# Altium schematic sheet Connector.SchDoc: Connectors
size A4; SheetNumber: 4; SheetTotal: 5
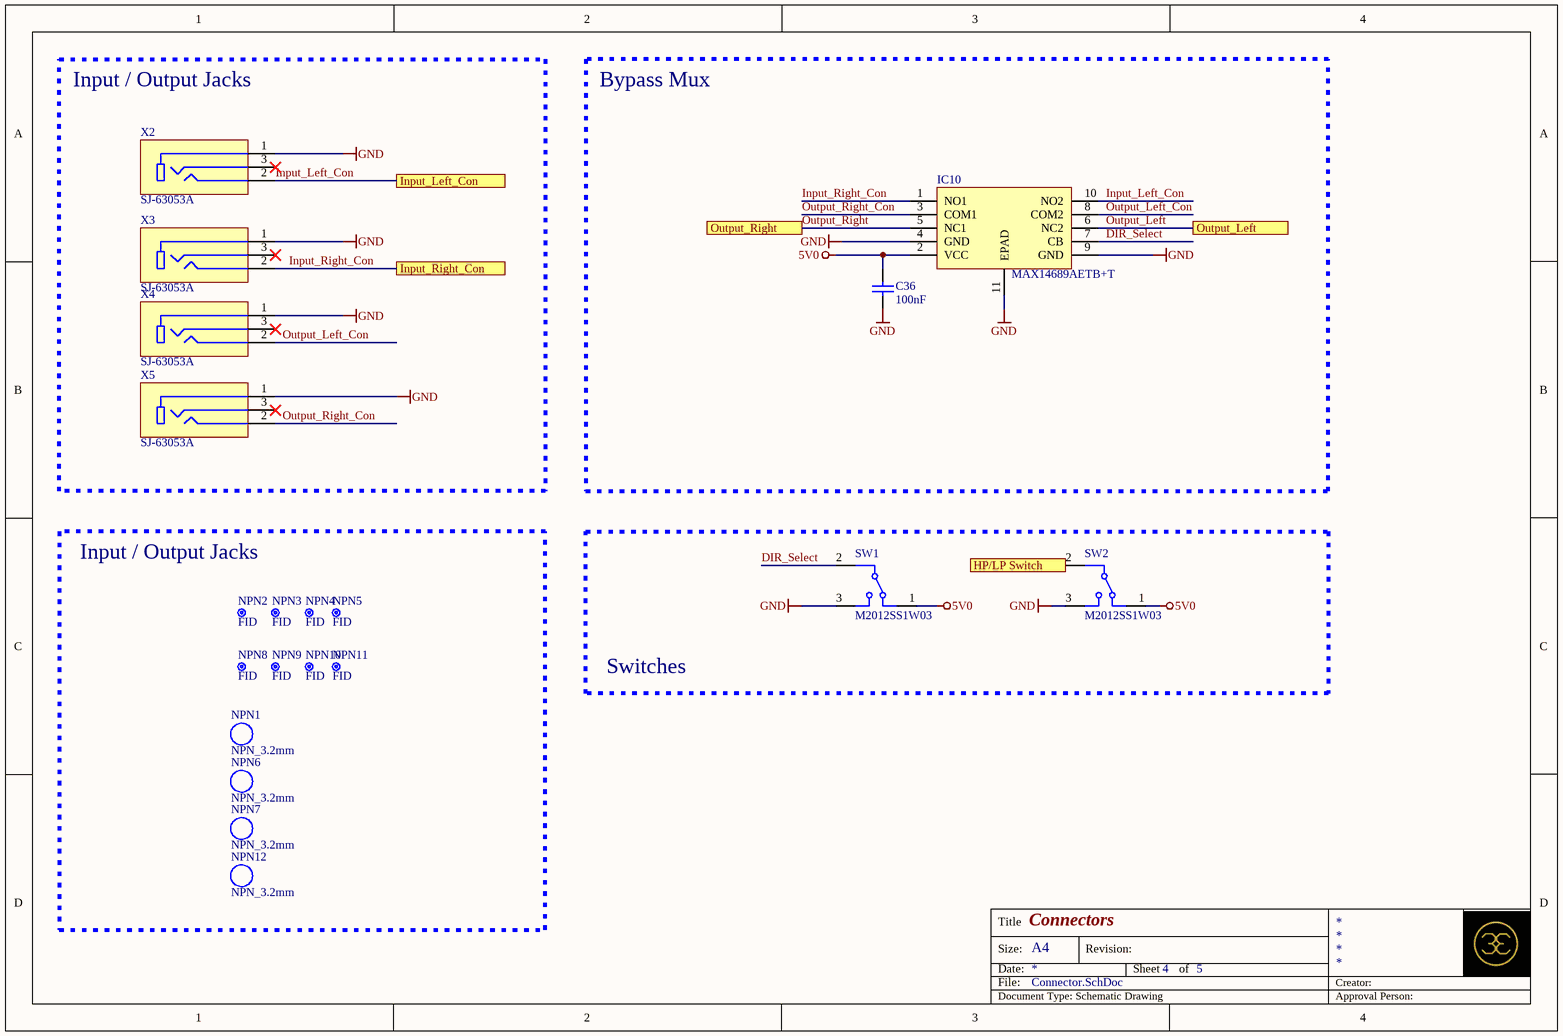
[diagram p0: Connector.SchDoc]

## Parts
C36  100nF  [CAPC1608X95N]
IC10  MAX14689AETB+T  [QFN40P200X250X80_HS-11N]
NPN1  NPN_3.2mm  [HOLE_NPH_3.2_M3]
NPN2  FID  [Fiducial_1mm]
NPN3  FID  [Fiducial_1mm]
NPN4  FID  [Fiducial_1mm]
NPN5  FID  [Fiducial_1mm]
NPN6  NPN_3.2mm  [HOLE_NPH_3.2_M3]
NPN7  NPN_3.2mm  [HOLE_NPH_3.2_M3]
NPN8  FID  [Fiducial_1mm]
NPN9  FID  [Fiducial_1mm]
NPN10  FID  [Fiducial_1mm]
NPN11  FID  [Fiducial_1mm]
NPN12  NPN_3.2mm  [HOLE_NPH_3.2_M3]
SW1  M2012SS1W03  [M2012SS1W03]
SW2  M2012SS1W03  [M2012SS1W03]
X2  SJ-63053A  [CUI_SJ-63053A]
X3  SJ-63053A  [CUI_SJ-63053A]
X4  SJ-63053A  [CUI_SJ-63053A]
X5  SJ-63053A  [CUI_SJ-63053A]

## Blocks framed on the sheet
Input / Output Jacks: X2-X5
Bypass Mux: C36 IC10
Input / Output Jacks: NPN1-NPN12
Switches: SW1 SW2

## Ports
HP/LP Switch, Input_Left_Con, Input_Right_Con, Output_Left, Output_Right

## Nets
5V0: C36.1 IC10.2(VCC) SW1.1 SW2.1
GND: C36.2 IC10.4(GND) IC10.9(GND) IC10.11(EPAD) SW1.3 SW2.3 X2.1 X3.1 X4.1 X5.1
DIR_Select: IC10.7(CB) SW1.2
HP/LP Switch: SW2.2 ; port HP/LP Switch
Input_Left_Con: IC10.10(NO2) X2.2 ; port Input_Left_Con
Input_Right_Con: IC10.1(NO1) X3.2 ; port Input_Right_Con
Output_Left: IC10.6(NC2) ; port Output_Left
Output_Left_Con: IC10.8(COM2) X4.2
Output_Right: IC10.5(NC1) ; port Output_Right
Output_Right_Con: IC10.3(COM1) X5.2

Not connected (* = marked no-connect by the designer): X2 3*; X3 3*; X4 3*; X5 3*

## Notes on the sheet
- Title
- Size:
- Date:
- File:
- A4
- Revision:
- Sheet
- of
- Creator:
- Document Type: Schematic Drawing
- Approval Person:

## Library data of the parts
C36 = CAP_100nF_0603: Multilayer Ceramic Capacitors MLCC - SMD/SMT, 100nF; Manufacturer: YAGEO; Manufacturer Part Number: CC0603KRX7R9BB104; Voltage Rating: 50VDC; Tolerance: 10%; Alternatives allowed: yes; JLC: C14663
IC10 = IC_MAX14689AETB+T: Analogue Switch ICs Ultra-Small, Low-RON, Beyond-the-Rails™, DPDT Analog Switches; Manufacturer: Maxim Integrated; Alternatives allowed: NO; Manufacturer Part Number: MAX14689AETB+T
NPN1 NPN6 NPN7 NPN12 = NPH_3.2mm_M3
NPN2-NPN5 NPN8-NPN11 = Fiducial_1mm
SW1 SW2 = SW_M2012SS1W03: Kippschalter SPDT Panelmontage; Manufacturer: NKK Switches; Alternatives allowed: NO; Manufacturer Part Number: M2012SS1W03
X2-X5 = Phone_Jack_1/4_SJ-63053A: Telefon-Steckverbinder 6.35 mm, Stereo, Right Angle, Through Hole Mount, 3 Conductors, 0 Internal Switches, Audio Jack Connector; Manufacturer: CUI Devices; Alternatives allowed: NO; Manufacturer Part Number: SJ-63053A